# Altium project Mongo KVM.PrjPcb
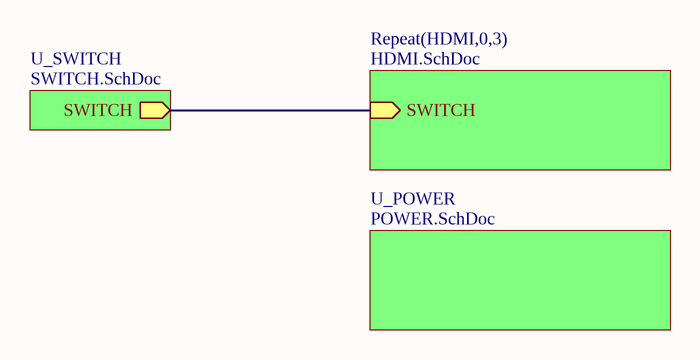
[diagram p0: TOP.SchDoc]
7 sheets, 38 parts. Net scope: hierarchical (ports join the sheet entries above them; power ports are global).
Board file: MONGO_KVM.PcbDoc
Sheets:
  TOP.SchDoc
    HDMI0 = HDMI.SchDoc
      U_HDMI_IN = HDMI_IN.SchDoc
      U_HDMI_SWITCH = HDMI_SWITCH.SchDoc
      U_HDMI_OUT = HDMI_OUT.SchDoc
    HDMI1 = HDMI.SchDoc
      U_HDMI_IN = HDMI_IN.SchDoc
      U_HDMI_SWITCH = HDMI_SWITCH.SchDoc
      U_HDMI_OUT = HDMI_OUT.SchDoc
    HDMI2 = HDMI.SchDoc
      U_HDMI_IN = HDMI_IN.SchDoc
      U_HDMI_SWITCH = HDMI_SWITCH.SchDoc
      U_HDMI_OUT = HDMI_OUT.SchDoc
    HDMI3 = HDMI.SchDoc
      U_HDMI_IN = HDMI_IN.SchDoc
      U_HDMI_SWITCH = HDMI_SWITCH.SchDoc
      U_HDMI_OUT = HDMI_OUT.SchDoc
    U_POWER = POWER.SchDoc
    U_SWITCH = SWITCH.SchDoc

## Sheet TOP.SchDoc
size A; SheetNumber: 1; SheetTotal: 7

### Sub-sheets
Repeat(HDMI,0,3) = HDMI.SchDoc: SWITCH (in)
U_POWER = POWER.SchDoc: no entries
U_SWITCH = SWITCH.SchDoc: SWITCH (out)

### Nets
NetQ1_4: sheet Repeat(HDMI,0,3)/SWITCH, sheet U_SWITCH/SWITCH

## Sheet HDMI.SchDoc
size A; SheetNumber: 2; SheetTotal: 12
Used 4 times, as channels HDMI0, HDMI1, HDMI2, HDMI3. Parts and nets are listed once, with the designators drawn on the sheet.
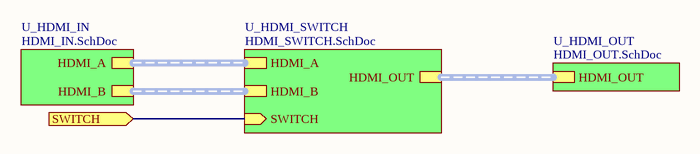
[diagram p1: HDMI.SchDoc]

### Sub-sheets
U_HDMI_IN = HDMI_IN.SchDoc: HDMI_A (harness HDMI_A), HDMI_B (harness HDMI_B)
U_HDMI_OUT = HDMI_OUT.SchDoc: HDMI_OUT (harness HDMI_OUT)
U_HDMI_SWITCH = HDMI_SWITCH.SchDoc: HDMI_A (harness HDMI_A), HDMI_B (harness HDMI_B), HDMI_OUT (harness HDMI_OUT), SWITCH (in)

### Ports
SWITCH (in, see TOP[2B], HDMI_SWITCH[1C])

### Nets
SWITCH: port SWITCH, sheet U_HDMI_SWITCH/SWITCH

### Channels
HDMI0: ports SWITCH=NetQ1_4
HDMI1: ports SWITCH=NetQ1_4
HDMI2: ports SWITCH=NetQ1_4
HDMI3: ports SWITCH=NetQ1_4

### Buses and harness runs
harness sheet U_HDMI_IN/HDMI_A = sheet U_HDMI_SWITCH/HDMI_A
harness sheet U_HDMI_IN/HDMI_B = sheet U_HDMI_SWITCH/HDMI_B
harness sheet U_HDMI_OUT/HDMI_OUT = sheet U_HDMI_SWITCH/HDMI_OUT

## Sheet HDMI_IN.SchDoc
size A; SheetNumber: 4; SheetTotal: 12
Used 4 times, as channels HDMI0/U_HDMI_IN, HDMI1/U_HDMI_IN, HDMI2/U_HDMI_IN, HDMI3/U_HDMI_IN. Parts and nets are listed once, with the designators drawn on the sheet.
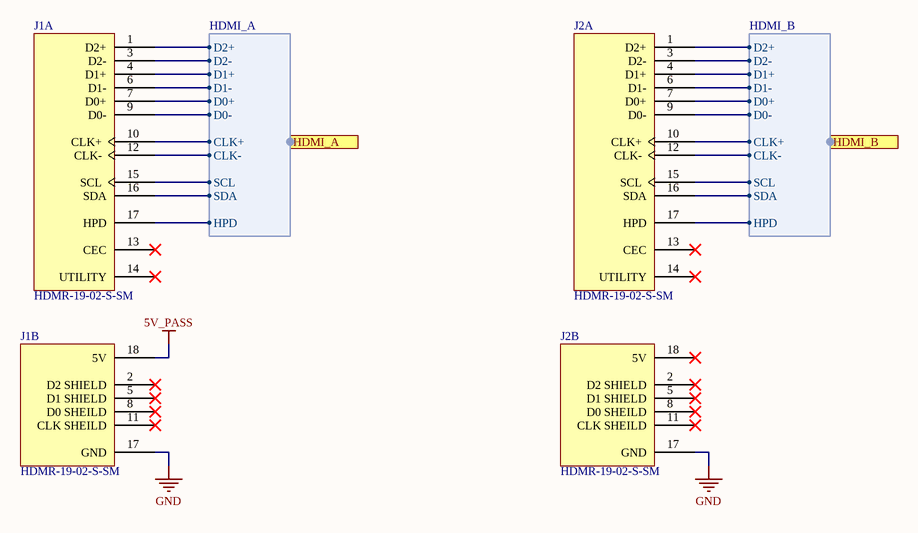
[diagram p2: HDMI_IN.SchDoc]

### Parts
J1  HDMR-19-02-S-SM  [SAMTEC_HDMR-19-02-S-SM]  (parts A,B of 2)
J2  HDMR-19-02-S-SM  [SAMTEC_HDMR-19-02-S-SM]  (parts A,B of 2)

### Ports
HDMI_A (harness HDMI_A, see HDMI[2B], HDMI_SWITCH[1A]), HDMI_B (harness HDMI_B, see HDMI[2B], HDMI_SWITCH[1B])

### Harnesses
HDMI_A: SCL, SDA, HPD, D0+, D0-, D1+, D1-, D2+, D2-, CLK+, CLK-
HDMI_B: SCL, SDA, HPD, D0+, D0-, D1+, D1-, D2+, D2-, CLK+, CLK-

### Nets
5V_PASS: J1.18(5V)
GND: J1.17(GND) J2.17(GND)
NetJ1_1: J1.1(D2+) ; port HDMI_A.D2+
NetJ1_3: J1.3(D2-) ; port HDMI_A.D2-
NetJ1_4: J1.4(D1+) ; port HDMI_A.D1+
NetJ1_6: J1.6(D1-) ; port HDMI_A.D1-
NetJ1_7: J1.7(D0+) ; port HDMI_A.D0+
NetJ1_9: J1.9(D0-) ; port HDMI_A.D0-
NetJ1_10: J1.10(CLK+) ; port HDMI_A.CLK+
NetJ1_12: J1.12(CLK-) ; port HDMI_A.CLK-
NetJ1_15: J1.15(SCL) ; port HDMI_A.SCL
NetJ1_16: J1.16(SDA) ; port HDMI_A.SDA
NetJ1_17: J1.17(HPD) ; port HDMI_A.HPD
NetJ2_1: J2.1(D2+) ; port HDMI_B.D2+
NetJ2_3: J2.3(D2-) ; port HDMI_B.D2-
NetJ2_4: J2.4(D1+) ; port HDMI_B.D1+
NetJ2_6: J2.6(D1-) ; port HDMI_B.D1-
NetJ2_7: J2.7(D0+) ; port HDMI_B.D0+
NetJ2_9: J2.9(D0-) ; port HDMI_B.D0-
NetJ2_10: J2.10(CLK+) ; port HDMI_B.CLK+
NetJ2_12: J2.12(CLK-) ; port HDMI_B.CLK-
NetJ2_15: J2.15(SCL) ; port HDMI_B.SCL
NetJ2_16: J2.16(SDA) ; port HDMI_B.SDA
NetJ2_17: J2.17(HPD) ; port HDMI_B.HPD

Not connected (* = marked no-connect by the designer): J1 2(D2_SHIELD)* 5(D1_SHIELD)* 8(D0_SHEILD)* 11(CLK_SHEILD)* 13(CEC)* 14(UTILITY)*; J2 2(D2_SHIELD)* 5(D1_SHIELD)* 8(D0_SHEILD)* 11(CLK_SHEILD)* 13(CEC)* 14(UTILITY)* 18(5V)*

### Channels
HDMI0/U_HDMI_IN: designators end in _HDMI0_U_HDMI_IN
HDMI1/U_HDMI_IN: designators end in _HDMI1_U_HDMI_IN
HDMI2/U_HDMI_IN: designators end in _HDMI2_U_HDMI_IN
HDMI3/U_HDMI_IN: designators end in _HDMI3_U_HDMI_IN

### Library data of the parts
J1 J2 = SAMTEC_HDMR-19-02-S-SM: Conn HDMI RCP 19 POS 0.5mm Solder RA SMD 19 Terminal 1 Port

## Sheet HDMI_SWITCH.SchDoc
size A; SheetNumber: 5; SheetTotal: 12
Used 4 times, as channels HDMI0/U_HDMI_SWITCH, HDMI1/U_HDMI_SWITCH, HDMI2/U_HDMI_SWITCH, HDMI3/U_HDMI_SWITCH. Parts and nets are listed once, with the designators drawn on the sheet.
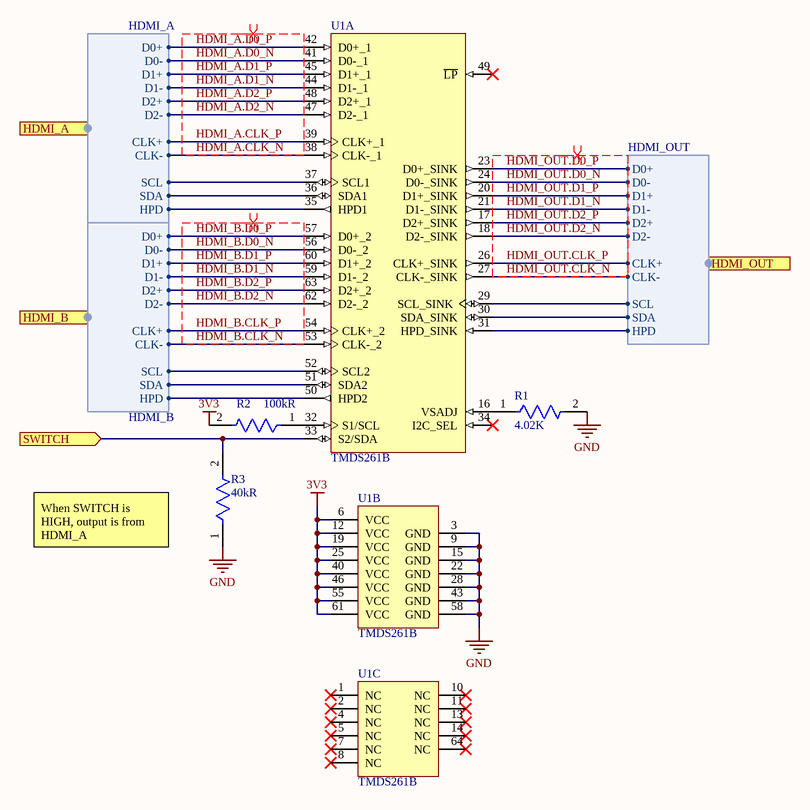
[diagram p3: HDMI_SWITCH.SchDoc]

### Parts
R1  value 4.02K  [FP-RT0402-MFG]  (hidden comment: RT0402)
R2  Resistance: 100kR  [FP-RK73H1J-IPC_C]  (hidden comment: RK73H1JLTD1003F)
R3  Resistance: 40kR  [FP-CRCW0805-e3-MFG]  (hidden comment: CRCW080540K0FKEA)
U1  TMDS261B  [PAG0064A_N]  (parts A,B,C of 3)

### Ports
HDMI_A (harness HDMI_A, see HDMI[2B], HDMI_IN[2B]), HDMI_B (harness HDMI_B, see HDMI[2B], HDMI_IN[4B]), HDMI_OUT (harness HDMI_OUT, see HDMI[3B], HDMI_OUT[2B]), SWITCH (in, see HDMI[2B], SWITCH[4B], USB[2C], USB_SWITCH_A[1B], USB_SWITCH_B[1B])

### Harnesses
HDMI_A: SCL, SDA, HPD, D0+, D0-, D1+, D1-, D2+, D2-, CLK+, CLK-
HDMI_B: SCL, SDA, HPD, D0+, D0-, D1+, D1-, D2+, D2-, CLK+, CLK-
HDMI_OUT: SCL, SDA, HPD, D0+, D0-, D1+, D1-, D2+, D2-, CLK+, CLK-

### Nets
3V3: R2.2 U1.6(VCC) U1.12(VCC) U1.19(VCC) U1.25(VCC) U1.40(VCC) U1.46(VCC) U1.55(VCC) U1.61(VCC)
GND: R1.2 R3.1 U1.3(GND) U1.9(GND) U1.15(GND) U1.22(GND) U1.28(GND) U1.43(GND) U1.58(GND)
HDMI_A.CLK_N: U1.38(CLK-_1) ; port HDMI_A.CLK-
HDMI_A.CLK_P: U1.39(CLK+_1) ; port HDMI_A.CLK+
HDMI_A.D0_N: U1.41(D0-_1) ; port HDMI_A.D0-
HDMI_A.D0_P: U1.42(D0+_1) ; port HDMI_A.D0+
HDMI_A.D1_N: U1.44(D1-_1) ; port HDMI_A.D1-
HDMI_A.D1_P: U1.45(D1+_1) ; port HDMI_A.D1+
HDMI_A.D2_N: U1.47(D2-_1) ; port HDMI_A.D2-
HDMI_A.D2_P: U1.48(D2+_1) ; port HDMI_A.D2+
HDMI_B.CLK_N: U1.53(CLK-_2) ; port HDMI_B.CLK-
HDMI_B.CLK_P: U1.54(CLK+_2) ; port HDMI_B.CLK+
HDMI_B.D0_N: U1.56(D0-_2) ; port HDMI_B.D0-
HDMI_B.D0_P: U1.57(D0+_2) ; port HDMI_B.D0+
HDMI_B.D1_N: U1.59(D1-_2) ; port HDMI_B.D1-
HDMI_B.D1_P: U1.60(D1+_2) ; port HDMI_B.D1+
HDMI_B.D2_N: U1.62(D2-_2) ; port HDMI_B.D2-
HDMI_B.D2_P: U1.63(D2+_2) ; port HDMI_B.D2+
HDMI_OUT.CLK_N: U1.27(CLK-_SINK) ; port HDMI_OUT.CLK-
HDMI_OUT.CLK_P: U1.26(CLK+_SINK) ; port HDMI_OUT.CLK+
HDMI_OUT.D0_N: U1.24(D0-_SINK) ; port HDMI_OUT.D0-
HDMI_OUT.D0_P: U1.23(D0+_SINK) ; port HDMI_OUT.D0+
HDMI_OUT.D1_N: U1.21(D1-_SINK) ; port HDMI_OUT.D1-
HDMI_OUT.D1_P: U1.20(D1+_SINK) ; port HDMI_OUT.D1+
HDMI_OUT.D2_N: U1.18(D2-_SINK) ; port HDMI_OUT.D2-
HDMI_OUT.D2_P: U1.17(D2+_SINK) ; port HDMI_OUT.D2+
SWITCH: R3.2 U1.33(S2/SDA) ; port SWITCH
NetR1_1: R1.1 U1.16(VSADJ)
NetR2_1: R2.1 U1.32(S1/SCL)
NetU1_29: U1.29(SCL_SINK) ; port HDMI_OUT.SCL
NetU1_30: U1.30(SDA_SINK) ; port HDMI_OUT.SDA
NetU1_31: U1.31(HPD_SINK) ; port HDMI_OUT.HPD
NetU1_35: U1.35(HPD1) ; port HDMI_A.HPD
NetU1_36: U1.36(SDA1) ; port HDMI_A.SDA
NetU1_37: U1.37(SCL1) ; port HDMI_A.SCL
NetU1_50: U1.50(HPD2) ; port HDMI_B.HPD
NetU1_51: U1.51(SDA2) ; port HDMI_B.SDA
NetU1_52: U1.52(SCL2) ; port HDMI_B.SCL

Not connected (* = marked no-connect by the designer): U1 1(NC)* 2(NC)* 4(NC)* 5(NC)* 7(NC)* 8(NC)* 10(NC)* 11(NC)* 13(NC)* 14(NC)* 34(I2C_SEL)* 49(~{LP})* 64(NC)*

### Channels
HDMI0/U_HDMI_SWITCH: designators end in _HDMI0_U_HDMI_SWITCH; ports SWITCH=NetQ1_4
HDMI1/U_HDMI_SWITCH: designators end in _HDMI1_U_HDMI_SWITCH; ports SWITCH=NetQ1_4
HDMI2/U_HDMI_SWITCH: designators end in _HDMI2_U_HDMI_SWITCH; ports SWITCH=NetQ1_4
HDMI3/U_HDMI_SWITCH: designators end in _HDMI3_U_HDMI_SWITCH; ports SWITCH=NetQ1_4

### Layout directives
differential pair: HDMI_A.CLK_N, HDMI_A.CLK_P, HDMI_A.D0_N, HDMI_A.D0_P, HDMI_A.D1_N, HDMI_A.D1_P, HDMI_A.D2_N, HDMI_A.D2_P, HDMI_B.CLK_N, HDMI_B.CLK_P, HDMI_B.D0_N, HDMI_B.D0_P, HDMI_B.D1_N, HDMI_B.D1_P, HDMI_B.D2_N, HDMI_B.D2_P, HDMI_OUT.CLK_N, HDMI_OUT.CLK_P, HDMI_OUT.D0_N, HDMI_OUT.D0_P, HDMI_OUT.D1_N, HDMI_OUT.D1_P, HDMI_OUT.D2_N, HDMI_OUT.D2_P

### Notes on the sheet
- When SWITCH is HIGH, output is from HDMI_A

### Library data of the parts
R1 = RT0402: RT0402 4.02KΩ 0.063W 50 ppm/°C 1.00%
R2 = CMP-04015-074272-1: 100kΩ ±1% 0.1W Chip Resistor 0603 Thick Film AEC-Q200 Qualified; Temperature Coefficient: 100ppm/°C; Power Rating: 100mW; Voltage Rating: 50V; Series: RK73H; Case/Package: 0603; Max Operating Temperature: 155°C; Case Code (Imperial): 0603; Length: 1.6mm; Package Quantity: 5000; Min Operating Temperature: -55°C; Tolerance: 1%; Termination: SMD/SMT; Packaging: Tape and Reel; Case Code (Metric): 1608; Height: 0.45mm; Width: 0.8mm; Lead Free: Contains Lead
R3 = CMP-02407-003498-1: RES Thick Film, 40kΩ, 1%, 0.125W, 100ppm/°C, 0805; Max Power Dissipation: 125mW; Tolerance: 1%; Features: Automotive AEC-Q200; Max Operating Temperature: 155°C; Composition: Thick Film; Length: 0.079inch; Case/Package: 0805; Min Operating Temperature: -55°C; Packaging: Tape and Reel; Number of Terminations: 2; Width: 0.049inch; Height: 0.02inch; Package Quantity: 5000; Lead Free: Lead Free; Temperature Coefficient: 100ppm/°C
U1 = TMDS261B: 3-Gbps 2-to-1 HDMI/DVI mux with adaptive equalization 64-TQFP 0 to 70

## Sheet HDMI_OUT.SchDoc
size A; SheetNumber: 6; SheetTotal: 10
Used 4 times, as channels HDMI0/U_HDMI_OUT, HDMI1/U_HDMI_OUT, HDMI2/U_HDMI_OUT, HDMI3/U_HDMI_OUT. Parts and nets are listed once, with the designators drawn on the sheet.
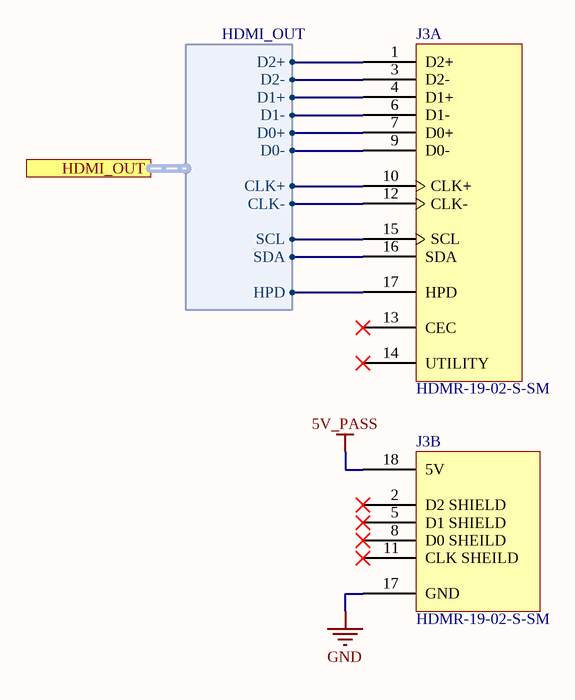
[diagram p4: HDMI_OUT.SchDoc]

### Parts
J3  HDMR-19-02-S-SM  [SAMTEC_HDMR-19-02-S-SM]  (parts A,B of 2)

### Ports
HDMI_OUT (harness HDMI_OUT, see HDMI[3B], HDMI_SWITCH[3B])

### Harnesses
HDMI_OUT: SCL, SDA, HPD, D0+, D0-, D1+, D1-, D2+, D2-, CLK+, CLK-

### Nets
5V_PASS: J3.18(5V)
GND: J3.17(GND)
NetJ3_1: J3.1(D2+) ; port HDMI_OUT.D2+
NetJ3_3: J3.3(D2-) ; port HDMI_OUT.D2-
NetJ3_4: J3.4(D1+) ; port HDMI_OUT.D1+
NetJ3_6: J3.6(D1-) ; port HDMI_OUT.D1-
NetJ3_7: J3.7(D0+) ; port HDMI_OUT.D0+
NetJ3_9: J3.9(D0-) ; port HDMI_OUT.D0-
NetJ3_10: J3.10(CLK+) ; port HDMI_OUT.CLK+
NetJ3_12: J3.12(CLK-) ; port HDMI_OUT.CLK-
NetJ3_15: J3.15(SCL) ; port HDMI_OUT.SCL
NetJ3_16: J3.16(SDA) ; port HDMI_OUT.SDA
NetJ3_17: J3.17(HPD) ; port HDMI_OUT.HPD

Not connected (* = marked no-connect by the designer): J3 2(D2_SHIELD)* 5(D1_SHIELD)* 8(D0_SHEILD)* 11(CLK_SHEILD)* 13(CEC)* 14(UTILITY)*

### Channels
HDMI0/U_HDMI_OUT: designators end in _HDMI0_U_HDMI_OUT
HDMI1/U_HDMI_OUT: designators end in _HDMI1_U_HDMI_OUT
HDMI2/U_HDMI_OUT: designators end in _HDMI2_U_HDMI_OUT
HDMI3/U_HDMI_OUT: designators end in _HDMI3_U_HDMI_OUT

### Library data of the parts
J3 = SAMTEC_HDMR-19-02-S-SM: as J1 on sheet HDMI_IN

## Sheet POWER.SchDoc
size A; SheetNumber: 7; SheetTotal: 7
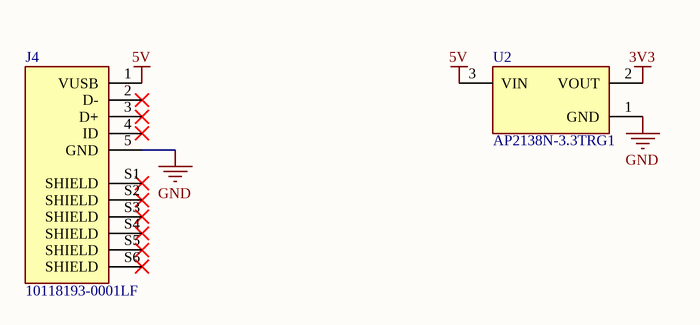
[diagram p5: POWER.SchDoc]

### Parts
J4  10118193-0001LF  [FCI_10118193-0001LF]
U2  AP2138N-3.3TRG1  [FP-SOT23-MFG]

### Nets
3V3: U2.2(VOUT)
5V: J4.1(VUSB) U2.3(VIN)
GND: J4.5(GND) U2.1(GND)

Not connected (* = marked no-connect by the designer): J4 2(D-)* 3(D+)* 4(ID)* S1(SHIELD)* S2(SHIELD)* S3(SHIELD)* S4(SHIELD)* S5(SHIELD)* S6(SHIELD)*

### Library data of the parts
J4 = 10118193-0001LF: USB - micro B USB 2.0 Receptacle Connector 5 Position Surface Mount, Right Angle; Through Hole; MF: Amphenol ICC; Availability: Unavailable; SnapEDA_Link: https://www.snapeda.com/parts/10118193-0001LF/Amphenol%20FCI/view-part/2758989/?ref=snap; MP: 10118193-0001LF; Price: None; Value: *; Package: None
U2 = AP2138N-3.3TRG1: IC REG LINEAR 3.3V 250MA SOT23-3

## Sheet SWITCH.SchDoc: SWITCH
size A; SheetNumber: 2; SheetTotal: 7
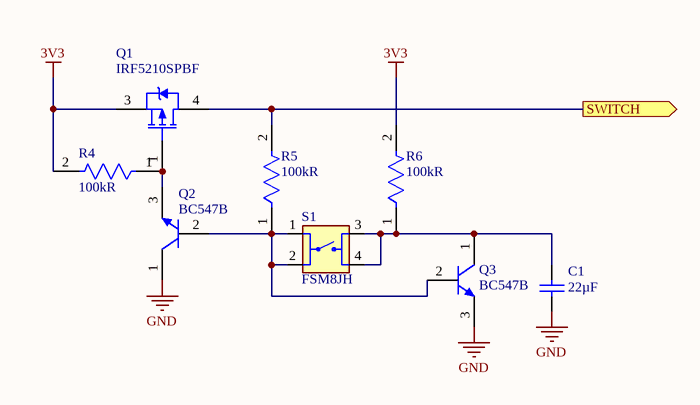
[diagram p6: SWITCH.SchDoc]

### Parts
C1  Capacitance: 22µF  [CAPC1608X100X20ML10]  (hidden comment: C1608X5R1A226M080AC)
Q1  IRF5210SPBF  [INTR-TO-263-3_L]
Q2  BC547B  [ONSC-TO-92-3-29-11]
Q3  BC547B  [ONSC-TO-92-3-29-11]
R4  Resistance: 100kR  [FP-RK73H1J-IPC_C]  (hidden comment: RK73H1JLTD1003F)
R5  Resistance: 100kR  [FP-RK73H1J-IPC_C]  (hidden comment: RK73H1JLTD1003F)
R6  Resistance: 100kR  [FP-RK73H1J-IPC_C]  (hidden comment: RK73H1JLTD1003F)
S1  FSM8JH  [SW_FSM8JH]

### Ports
SWITCH (out, see TOP[2B], HDMI[2B], HDMI_SWITCH[1C])

### Nets
3V3: Q1.3(SOURCE) R4.2 R6.2
GND: C1.1 Q2.1(C) Q3.3(E)
NetC1_2: C1.2 Q3.1(C) R6.1 S1.3 S1.4
NetQ1_1: Q1.1(GATE) Q2.3(E) R4.1
NetQ1_4: Q1.4(DRAIN) R5.2 ; port SWITCH
NetQ2_2: Q2.2(B) Q3.2(B) R5.1 S1.1 S1.2

### Library data of the parts
C1 = CMP-2000-05441-1: Chip Capacitor, 22 uF, +/- 20%, 10 V, -55 to 85 degC, 0603 (1608 Metric), RoHS, Tape and Reel; Manufacturer: TDK; PCN Part Number: MLCCPartNumberChange30/Nov/2012; Voltage - Rated: 10V; Product Training Modules: CSeriesGeneralApplicationsSEAT,CCV,andTVCLDesignToolsGuidetoReplacinganElectrolyticCapacitorwithanMLCC; Other Names: 445-9077-1; Design Resources: 20WNon-IsolatedBuckLEDDriverUsingPLLNK460KG; Online Catalog: CSeries,GeneralPurpose; Temperature Coefficient: X5R; Kits: 445-9014-KIT-ND-KITMLCC100PF-22UF060310-50V; Packaging: CutTape(CT); Standard Package: 1; Package / Case: 0603(1608Metric); Lead Style: -; Features: -; Ratings: -; Operating Temperature: -55degC~85degC; Applications: GeneralPurpose; Package Reference: 603; Datasheet URL: http://download.siliconexpert.com/pdfs/2015/4/21/15/54/45/779/tdk_/manual/37024850441143360mlcc_commercial_general_en.pdf; Datasheet Version: Mar-15; Mounting Type: SurfaceMount,MLCC; Lead Spacing: -; Size / Dimension: 0.063"Lx0.031"W(1.60mmx0.80mm); Height - Seated (Max): -; Package Description: 2-Pin Surface Mount Device, Body 1.6 x 0.8 mm; Manufacturer URL: http://www.tdk.com/; RoHS Information: RoHSCertificate-MLCC; Tolerance: ±20%; Series: C; Thickness (Max): 0.035"(0.90mm); Family: CeramicCapacitors; Category: Capacitors
Q1 = CMP-2000-06459-1: HEXFET(R) Power MOSFET, 3.1 W, 63 ns, -55 to 150 degC, 3-Pin DPAK (TO-263AB), RoHS, Tube; Manufacturer: International Rectifier; Drain-Source On Resistance-Max: 60mO; Rated Power Dissipation: 170W; Qg Gate Charge: 150nC; Channel Type: P-Channel; Drain-to-Source Voltage [Vdss]: 100V; Datasheet Version: 08/2009; Datasheet URL: https://datasheet.ciiva.com/15137/getdatasheetpartid-86705-15137623.pdf; Package Reference: TO-263-3; Package Description: 3-Pin Transistor Outline, Body 9.015 x 10.16 mm, Pitch 2.54 mm; Manufacturer URL: http://internationalrectifier.com/; Mounting Technology: SurfaceMount
Q2 Q3 = CMP-1048-01467-1: Amplifier Transistor, NPN Silicon, 3-Pin TO-92, Bulk Box; Manufacturer: On Semiconductor; IC Continuous (A): 0.1; fT Min (MHz): 150; DatasheetVersion: Rev. 7; ComponentLink1URL: http://www.onsemi.com/; Polarity: NPN; RoHS: FALSE; ComponentLink1Description: Manufacturer URL; Packing: Bulk Box; PackageDescription: 3-Pin Transistor Outline, Body 4.825 x 3.685 mm, Pitch 1.27 mm; ComponentLink3URL: http://www.onsemi.cn/pub_link/Collateral/2N6426-D.PDF; ComponentLink2Description: Datasheet; PackageVersion: Rev. AM; PackageReference: TO-92-3-29-11_AM_SL; ComponentLink3Description: Package Specification; Mounting Technology: Through Hole; PartNumber: BC547B; ComponentLink2URL: http://www.onsemi.com/pub_link/Collateral/BC546-D.PDF
R4-R6 = CMP-04015-074272-1: as R2 on sheet HDMI_SWITCH; Series: RK73H; Case/Package: 0603; Max Operating Temperature: 155°C; Case Code (Imperial): 0603; Length: 1.6mm; Package Quantity: 5000; Min Operating Temperature: -55°C; Tolerance: 1%; Termination: SMD/SMT; Packaging: Tape and Reel; Case Code (Metric): 1608; Height: 0.45mm; Width: 0.8mm; Lead Free: Contains Lead
S1 = FSM8JH: Switch, Pushbutton, Tactile, SPST, Thru Hole, Vertical, 6MM, Black; Value: *; MP: FSM8JH; Package: None; Availability: Unavailable; Price: None

## Nets that join several sheets
3V3: HDMI0/U_HDMI_SWITCH (9 pins), HDMI1/U_HDMI_SWITCH (9 pins), HDMI2/U_HDMI_SWITCH (9 pins), HDMI3/U_HDMI_SWITCH (9 pins), POWER (U2.2), SWITCH (Q1.3 R4.2 R6.2)
5V_PASS: HDMI0/U_HDMI_IN (J1_HDMI0_U_HDMI_IN.18), HDMI0/U_HDMI_OUT (J3_HDMI0_U_HDMI_OUT.18), HDMI1/U_HDMI_IN (J1_HDMI1_U_HDMI_IN.18), HDMI1/U_HDMI_OUT (J3_HDMI1_U_HDMI_OUT.18), HDMI2/U_HDMI_IN (J1_HDMI2_U_HDMI_IN.18), HDMI2/U_HDMI_OUT (J3_HDMI2_U_HDMI_OUT.18), HDMI3/U_HDMI_IN (J1_HDMI3_U_HDMI_IN.18), HDMI3/U_HDMI_OUT (J3_HDMI3_U_HDMI_OUT.18)
GND: HDMI0/U_HDMI_IN (J1_HDMI0_U_HDMI_IN.17 J2_HDMI0_U_HDMI_IN.17), HDMI0/U_HDMI_SWITCH (9 pins), HDMI0/U_HDMI_OUT (J3_HDMI0_U_HDMI_OUT.17), HDMI1/U_HDMI_IN (J1_HDMI1_U_HDMI_IN.17 J2_HDMI1_U_HDMI_IN.17), HDMI1/U_HDMI_SWITCH (9 pins), HDMI1/U_HDMI_OUT (J3_HDMI1_U_HDMI_OUT.17), HDMI2/U_HDMI_IN (J1_HDMI2_U_HDMI_IN.17 J2_HDMI2_U_HDMI_IN.17), HDMI2/U_HDMI_SWITCH (9 pins), HDMI2/U_HDMI_OUT (J3_HDMI2_U_HDMI_OUT.17), HDMI3/U_HDMI_IN (J1_HDMI3_U_HDMI_IN.17 J2_HDMI3_U_HDMI_IN.17), HDMI3/U_HDMI_SWITCH (9 pins), HDMI3/U_HDMI_OUT (J3_HDMI3_U_HDMI_OUT.17), POWER (J4.5 U2.1), SWITCH (C1.1 Q2.1 Q3.3)
HDMI_A.CLK_N: HDMI0/U_HDMI_IN (J1_HDMI0_U_HDMI_IN.12), HDMI0/U_HDMI_SWITCH (U1_HDMI0_U_HDMI_SWITCH.38)
HDMI_A.CLK_N: HDMI1/U_HDMI_IN (J1_HDMI1_U_HDMI_IN.12), HDMI1/U_HDMI_SWITCH (U1_HDMI1_U_HDMI_SWITCH.38)
HDMI_A.CLK_N: HDMI2/U_HDMI_IN (J1_HDMI2_U_HDMI_IN.12), HDMI2/U_HDMI_SWITCH (U1_HDMI2_U_HDMI_SWITCH.38)
HDMI_A.CLK_N: HDMI3/U_HDMI_IN (J1_HDMI3_U_HDMI_IN.12), HDMI3/U_HDMI_SWITCH (U1_HDMI3_U_HDMI_SWITCH.38)
HDMI_A.CLK_P: HDMI0/U_HDMI_IN (J1_HDMI0_U_HDMI_IN.10), HDMI0/U_HDMI_SWITCH (U1_HDMI0_U_HDMI_SWITCH.39)
HDMI_A.CLK_P: HDMI1/U_HDMI_IN (J1_HDMI1_U_HDMI_IN.10), HDMI1/U_HDMI_SWITCH (U1_HDMI1_U_HDMI_SWITCH.39)
HDMI_A.CLK_P: HDMI2/U_HDMI_IN (J1_HDMI2_U_HDMI_IN.10), HDMI2/U_HDMI_SWITCH (U1_HDMI2_U_HDMI_SWITCH.39)
HDMI_A.CLK_P: HDMI3/U_HDMI_IN (J1_HDMI3_U_HDMI_IN.10), HDMI3/U_HDMI_SWITCH (U1_HDMI3_U_HDMI_SWITCH.39)
HDMI_A.D0_N: HDMI0/U_HDMI_IN (J1_HDMI0_U_HDMI_IN.9), HDMI0/U_HDMI_SWITCH (U1_HDMI0_U_HDMI_SWITCH.41)
HDMI_A.D0_N: HDMI1/U_HDMI_IN (J1_HDMI1_U_HDMI_IN.9), HDMI1/U_HDMI_SWITCH (U1_HDMI1_U_HDMI_SWITCH.41)
HDMI_A.D0_N: HDMI2/U_HDMI_IN (J1_HDMI2_U_HDMI_IN.9), HDMI2/U_HDMI_SWITCH (U1_HDMI2_U_HDMI_SWITCH.41)
HDMI_A.D0_N: HDMI3/U_HDMI_IN (J1_HDMI3_U_HDMI_IN.9), HDMI3/U_HDMI_SWITCH (U1_HDMI3_U_HDMI_SWITCH.41)
HDMI_A.D0_P: HDMI0/U_HDMI_IN (J1_HDMI0_U_HDMI_IN.7), HDMI0/U_HDMI_SWITCH (U1_HDMI0_U_HDMI_SWITCH.42)
HDMI_A.D0_P: HDMI1/U_HDMI_IN (J1_HDMI1_U_HDMI_IN.7), HDMI1/U_HDMI_SWITCH (U1_HDMI1_U_HDMI_SWITCH.42)
HDMI_A.D0_P: HDMI2/U_HDMI_IN (J1_HDMI2_U_HDMI_IN.7), HDMI2/U_HDMI_SWITCH (U1_HDMI2_U_HDMI_SWITCH.42)
HDMI_A.D0_P: HDMI3/U_HDMI_IN (J1_HDMI3_U_HDMI_IN.7), HDMI3/U_HDMI_SWITCH (U1_HDMI3_U_HDMI_SWITCH.42)
HDMI_A.D1_N: HDMI0/U_HDMI_IN (J1_HDMI0_U_HDMI_IN.6), HDMI0/U_HDMI_SWITCH (U1_HDMI0_U_HDMI_SWITCH.44)
HDMI_A.D1_N: HDMI1/U_HDMI_IN (J1_HDMI1_U_HDMI_IN.6), HDMI1/U_HDMI_SWITCH (U1_HDMI1_U_HDMI_SWITCH.44)
HDMI_A.D1_N: HDMI2/U_HDMI_IN (J1_HDMI2_U_HDMI_IN.6), HDMI2/U_HDMI_SWITCH (U1_HDMI2_U_HDMI_SWITCH.44)
HDMI_A.D1_N: HDMI3/U_HDMI_IN (J1_HDMI3_U_HDMI_IN.6), HDMI3/U_HDMI_SWITCH (U1_HDMI3_U_HDMI_SWITCH.44)
HDMI_A.D1_P: HDMI0/U_HDMI_IN (J1_HDMI0_U_HDMI_IN.4), HDMI0/U_HDMI_SWITCH (U1_HDMI0_U_HDMI_SWITCH.45)
HDMI_A.D1_P: HDMI1/U_HDMI_IN (J1_HDMI1_U_HDMI_IN.4), HDMI1/U_HDMI_SWITCH (U1_HDMI1_U_HDMI_SWITCH.45)
HDMI_A.D1_P: HDMI2/U_HDMI_IN (J1_HDMI2_U_HDMI_IN.4), HDMI2/U_HDMI_SWITCH (U1_HDMI2_U_HDMI_SWITCH.45)
HDMI_A.D1_P: HDMI3/U_HDMI_IN (J1_HDMI3_U_HDMI_IN.4), HDMI3/U_HDMI_SWITCH (U1_HDMI3_U_HDMI_SWITCH.45)
HDMI_A.D2_N: HDMI0/U_HDMI_IN (J1_HDMI0_U_HDMI_IN.3), HDMI0/U_HDMI_SWITCH (U1_HDMI0_U_HDMI_SWITCH.47)
HDMI_A.D2_N: HDMI1/U_HDMI_IN (J1_HDMI1_U_HDMI_IN.3), HDMI1/U_HDMI_SWITCH (U1_HDMI1_U_HDMI_SWITCH.47)
HDMI_A.D2_N: HDMI2/U_HDMI_IN (J1_HDMI2_U_HDMI_IN.3), HDMI2/U_HDMI_SWITCH (U1_HDMI2_U_HDMI_SWITCH.47)
HDMI_A.D2_N: HDMI3/U_HDMI_IN (J1_HDMI3_U_HDMI_IN.3), HDMI3/U_HDMI_SWITCH (U1_HDMI3_U_HDMI_SWITCH.47)
HDMI_A.D2_P: HDMI0/U_HDMI_IN (J1_HDMI0_U_HDMI_IN.1), HDMI0/U_HDMI_SWITCH (U1_HDMI0_U_HDMI_SWITCH.48)
HDMI_A.D2_P: HDMI1/U_HDMI_IN (J1_HDMI1_U_HDMI_IN.1), HDMI1/U_HDMI_SWITCH (U1_HDMI1_U_HDMI_SWITCH.48)
HDMI_A.D2_P: HDMI2/U_HDMI_IN (J1_HDMI2_U_HDMI_IN.1), HDMI2/U_HDMI_SWITCH (U1_HDMI2_U_HDMI_SWITCH.48)
HDMI_A.D2_P: HDMI3/U_HDMI_IN (J1_HDMI3_U_HDMI_IN.1), HDMI3/U_HDMI_SWITCH (U1_HDMI3_U_HDMI_SWITCH.48)
HDMI_B.CLK_N: HDMI0/U_HDMI_IN (J2_HDMI0_U_HDMI_IN.12), HDMI0/U_HDMI_SWITCH (U1_HDMI0_U_HDMI_SWITCH.53)
HDMI_B.CLK_N: HDMI1/U_HDMI_IN (J2_HDMI1_U_HDMI_IN.12), HDMI1/U_HDMI_SWITCH (U1_HDMI1_U_HDMI_SWITCH.53)
HDMI_B.CLK_N: HDMI2/U_HDMI_IN (J2_HDMI2_U_HDMI_IN.12), HDMI2/U_HDMI_SWITCH (U1_HDMI2_U_HDMI_SWITCH.53)
HDMI_B.CLK_N: HDMI3/U_HDMI_IN (J2_HDMI3_U_HDMI_IN.12), HDMI3/U_HDMI_SWITCH (U1_HDMI3_U_HDMI_SWITCH.53)
HDMI_B.CLK_P: HDMI0/U_HDMI_IN (J2_HDMI0_U_HDMI_IN.10), HDMI0/U_HDMI_SWITCH (U1_HDMI0_U_HDMI_SWITCH.54)
HDMI_B.CLK_P: HDMI1/U_HDMI_IN (J2_HDMI1_U_HDMI_IN.10), HDMI1/U_HDMI_SWITCH (U1_HDMI1_U_HDMI_SWITCH.54)
HDMI_B.CLK_P: HDMI2/U_HDMI_IN (J2_HDMI2_U_HDMI_IN.10), HDMI2/U_HDMI_SWITCH (U1_HDMI2_U_HDMI_SWITCH.54)
HDMI_B.CLK_P: HDMI3/U_HDMI_IN (J2_HDMI3_U_HDMI_IN.10), HDMI3/U_HDMI_SWITCH (U1_HDMI3_U_HDMI_SWITCH.54)
HDMI_B.D0_N: HDMI0/U_HDMI_IN (J2_HDMI0_U_HDMI_IN.9), HDMI0/U_HDMI_SWITCH (U1_HDMI0_U_HDMI_SWITCH.56)
HDMI_B.D0_N: HDMI1/U_HDMI_IN (J2_HDMI1_U_HDMI_IN.9), HDMI1/U_HDMI_SWITCH (U1_HDMI1_U_HDMI_SWITCH.56)
HDMI_B.D0_N: HDMI2/U_HDMI_IN (J2_HDMI2_U_HDMI_IN.9), HDMI2/U_HDMI_SWITCH (U1_HDMI2_U_HDMI_SWITCH.56)
HDMI_B.D0_N: HDMI3/U_HDMI_IN (J2_HDMI3_U_HDMI_IN.9), HDMI3/U_HDMI_SWITCH (U1_HDMI3_U_HDMI_SWITCH.56)
HDMI_B.D0_P: HDMI0/U_HDMI_IN (J2_HDMI0_U_HDMI_IN.7), HDMI0/U_HDMI_SWITCH (U1_HDMI0_U_HDMI_SWITCH.57)
HDMI_B.D0_P: HDMI1/U_HDMI_IN (J2_HDMI1_U_HDMI_IN.7), HDMI1/U_HDMI_SWITCH (U1_HDMI1_U_HDMI_SWITCH.57)
HDMI_B.D0_P: HDMI2/U_HDMI_IN (J2_HDMI2_U_HDMI_IN.7), HDMI2/U_HDMI_SWITCH (U1_HDMI2_U_HDMI_SWITCH.57)
HDMI_B.D0_P: HDMI3/U_HDMI_IN (J2_HDMI3_U_HDMI_IN.7), HDMI3/U_HDMI_SWITCH (U1_HDMI3_U_HDMI_SWITCH.57)
HDMI_B.D1_N: HDMI0/U_HDMI_IN (J2_HDMI0_U_HDMI_IN.6), HDMI0/U_HDMI_SWITCH (U1_HDMI0_U_HDMI_SWITCH.59)
HDMI_B.D1_N: HDMI1/U_HDMI_IN (J2_HDMI1_U_HDMI_IN.6), HDMI1/U_HDMI_SWITCH (U1_HDMI1_U_HDMI_SWITCH.59)
HDMI_B.D1_N: HDMI2/U_HDMI_IN (J2_HDMI2_U_HDMI_IN.6), HDMI2/U_HDMI_SWITCH (U1_HDMI2_U_HDMI_SWITCH.59)
HDMI_B.D1_N: HDMI3/U_HDMI_IN (J2_HDMI3_U_HDMI_IN.6), HDMI3/U_HDMI_SWITCH (U1_HDMI3_U_HDMI_SWITCH.59)
HDMI_B.D1_P: HDMI0/U_HDMI_IN (J2_HDMI0_U_HDMI_IN.4), HDMI0/U_HDMI_SWITCH (U1_HDMI0_U_HDMI_SWITCH.60)
HDMI_B.D1_P: HDMI1/U_HDMI_IN (J2_HDMI1_U_HDMI_IN.4), HDMI1/U_HDMI_SWITCH (U1_HDMI1_U_HDMI_SWITCH.60)
HDMI_B.D1_P: HDMI2/U_HDMI_IN (J2_HDMI2_U_HDMI_IN.4), HDMI2/U_HDMI_SWITCH (U1_HDMI2_U_HDMI_SWITCH.60)
HDMI_B.D1_P: HDMI3/U_HDMI_IN (J2_HDMI3_U_HDMI_IN.4), HDMI3/U_HDMI_SWITCH (U1_HDMI3_U_HDMI_SWITCH.60)
HDMI_B.D2_N: HDMI0/U_HDMI_IN (J2_HDMI0_U_HDMI_IN.3), HDMI0/U_HDMI_SWITCH (U1_HDMI0_U_HDMI_SWITCH.62)
HDMI_B.D2_N: HDMI1/U_HDMI_IN (J2_HDMI1_U_HDMI_IN.3), HDMI1/U_HDMI_SWITCH (U1_HDMI1_U_HDMI_SWITCH.62)
HDMI_B.D2_N: HDMI2/U_HDMI_IN (J2_HDMI2_U_HDMI_IN.3), HDMI2/U_HDMI_SWITCH (U1_HDMI2_U_HDMI_SWITCH.62)
HDMI_B.D2_N: HDMI3/U_HDMI_IN (J2_HDMI3_U_HDMI_IN.3), HDMI3/U_HDMI_SWITCH (U1_HDMI3_U_HDMI_SWITCH.62)
HDMI_B.D2_P: HDMI0/U_HDMI_IN (J2_HDMI0_U_HDMI_IN.1), HDMI0/U_HDMI_SWITCH (U1_HDMI0_U_HDMI_SWITCH.63)
HDMI_B.D2_P: HDMI1/U_HDMI_IN (J2_HDMI1_U_HDMI_IN.1), HDMI1/U_HDMI_SWITCH (U1_HDMI1_U_HDMI_SWITCH.63)
HDMI_B.D2_P: HDMI2/U_HDMI_IN (J2_HDMI2_U_HDMI_IN.1), HDMI2/U_HDMI_SWITCH (U1_HDMI2_U_HDMI_SWITCH.63)
HDMI_B.D2_P: HDMI3/U_HDMI_IN (J2_HDMI3_U_HDMI_IN.1), HDMI3/U_HDMI_SWITCH (U1_HDMI3_U_HDMI_SWITCH.63)
HDMI_OUT.CLK_N: HDMI0/U_HDMI_SWITCH (U1_HDMI0_U_HDMI_SWITCH.27), HDMI0/U_HDMI_OUT (J3_HDMI0_U_HDMI_OUT.12)
HDMI_OUT.CLK_N: HDMI1/U_HDMI_SWITCH (U1_HDMI1_U_HDMI_SWITCH.27), HDMI1/U_HDMI_OUT (J3_HDMI1_U_HDMI_OUT.12)
HDMI_OUT.CLK_N: HDMI2/U_HDMI_SWITCH (U1_HDMI2_U_HDMI_SWITCH.27), HDMI2/U_HDMI_OUT (J3_HDMI2_U_HDMI_OUT.12)
HDMI_OUT.CLK_N: HDMI3/U_HDMI_SWITCH (U1_HDMI3_U_HDMI_SWITCH.27), HDMI3/U_HDMI_OUT (J3_HDMI3_U_HDMI_OUT.12)
HDMI_OUT.CLK_P: HDMI0/U_HDMI_SWITCH (U1_HDMI0_U_HDMI_SWITCH.26), HDMI0/U_HDMI_OUT (J3_HDMI0_U_HDMI_OUT.10)
HDMI_OUT.CLK_P: HDMI1/U_HDMI_SWITCH (U1_HDMI1_U_HDMI_SWITCH.26), HDMI1/U_HDMI_OUT (J3_HDMI1_U_HDMI_OUT.10)
HDMI_OUT.CLK_P: HDMI2/U_HDMI_SWITCH (U1_HDMI2_U_HDMI_SWITCH.26), HDMI2/U_HDMI_OUT (J3_HDMI2_U_HDMI_OUT.10)
HDMI_OUT.CLK_P: HDMI3/U_HDMI_SWITCH (U1_HDMI3_U_HDMI_SWITCH.26), HDMI3/U_HDMI_OUT (J3_HDMI3_U_HDMI_OUT.10)
HDMI_OUT.D0_N: HDMI0/U_HDMI_SWITCH (U1_HDMI0_U_HDMI_SWITCH.24), HDMI0/U_HDMI_OUT (J3_HDMI0_U_HDMI_OUT.9)
HDMI_OUT.D0_N: HDMI1/U_HDMI_SWITCH (U1_HDMI1_U_HDMI_SWITCH.24), HDMI1/U_HDMI_OUT (J3_HDMI1_U_HDMI_OUT.9)
HDMI_OUT.D0_N: HDMI2/U_HDMI_SWITCH (U1_HDMI2_U_HDMI_SWITCH.24), HDMI2/U_HDMI_OUT (J3_HDMI2_U_HDMI_OUT.9)
HDMI_OUT.D0_N: HDMI3/U_HDMI_SWITCH (U1_HDMI3_U_HDMI_SWITCH.24), HDMI3/U_HDMI_OUT (J3_HDMI3_U_HDMI_OUT.9)
HDMI_OUT.D0_P: HDMI0/U_HDMI_SWITCH (U1_HDMI0_U_HDMI_SWITCH.23), HDMI0/U_HDMI_OUT (J3_HDMI0_U_HDMI_OUT.7)
HDMI_OUT.D0_P: HDMI1/U_HDMI_SWITCH (U1_HDMI1_U_HDMI_SWITCH.23), HDMI1/U_HDMI_OUT (J3_HDMI1_U_HDMI_OUT.7)
HDMI_OUT.D0_P: HDMI2/U_HDMI_SWITCH (U1_HDMI2_U_HDMI_SWITCH.23), HDMI2/U_HDMI_OUT (J3_HDMI2_U_HDMI_OUT.7)
HDMI_OUT.D0_P: HDMI3/U_HDMI_SWITCH (U1_HDMI3_U_HDMI_SWITCH.23), HDMI3/U_HDMI_OUT (J3_HDMI3_U_HDMI_OUT.7)
HDMI_OUT.D1_N: HDMI0/U_HDMI_SWITCH (U1_HDMI0_U_HDMI_SWITCH.21), HDMI0/U_HDMI_OUT (J3_HDMI0_U_HDMI_OUT.6)
HDMI_OUT.D1_N: HDMI1/U_HDMI_SWITCH (U1_HDMI1_U_HDMI_SWITCH.21), HDMI1/U_HDMI_OUT (J3_HDMI1_U_HDMI_OUT.6)
HDMI_OUT.D1_N: HDMI2/U_HDMI_SWITCH (U1_HDMI2_U_HDMI_SWITCH.21), HDMI2/U_HDMI_OUT (J3_HDMI2_U_HDMI_OUT.6)
HDMI_OUT.D1_N: HDMI3/U_HDMI_SWITCH (U1_HDMI3_U_HDMI_SWITCH.21), HDMI3/U_HDMI_OUT (J3_HDMI3_U_HDMI_OUT.6)
HDMI_OUT.D1_P: HDMI0/U_HDMI_SWITCH (U1_HDMI0_U_HDMI_SWITCH.20), HDMI0/U_HDMI_OUT (J3_HDMI0_U_HDMI_OUT.4)
HDMI_OUT.D1_P: HDMI1/U_HDMI_SWITCH (U1_HDMI1_U_HDMI_SWITCH.20), HDMI1/U_HDMI_OUT (J3_HDMI1_U_HDMI_OUT.4)
HDMI_OUT.D1_P: HDMI2/U_HDMI_SWITCH (U1_HDMI2_U_HDMI_SWITCH.20), HDMI2/U_HDMI_OUT (J3_HDMI2_U_HDMI_OUT.4)
HDMI_OUT.D1_P: HDMI3/U_HDMI_SWITCH (U1_HDMI3_U_HDMI_SWITCH.20), HDMI3/U_HDMI_OUT (J3_HDMI3_U_HDMI_OUT.4)
HDMI_OUT.D2_N: HDMI0/U_HDMI_SWITCH (U1_HDMI0_U_HDMI_SWITCH.18), HDMI0/U_HDMI_OUT (J3_HDMI0_U_HDMI_OUT.3)
HDMI_OUT.D2_N: HDMI1/U_HDMI_SWITCH (U1_HDMI1_U_HDMI_SWITCH.18), HDMI1/U_HDMI_OUT (J3_HDMI1_U_HDMI_OUT.3)
HDMI_OUT.D2_N: HDMI2/U_HDMI_SWITCH (U1_HDMI2_U_HDMI_SWITCH.18), HDMI2/U_HDMI_OUT (J3_HDMI2_U_HDMI_OUT.3)
HDMI_OUT.D2_N: HDMI3/U_HDMI_SWITCH (U1_HDMI3_U_HDMI_SWITCH.18), HDMI3/U_HDMI_OUT (J3_HDMI3_U_HDMI_OUT.3)
HDMI_OUT.D2_P: HDMI0/U_HDMI_SWITCH (U1_HDMI0_U_HDMI_SWITCH.17), HDMI0/U_HDMI_OUT (J3_HDMI0_U_HDMI_OUT.1)
HDMI_OUT.D2_P: HDMI1/U_HDMI_SWITCH (U1_HDMI1_U_HDMI_SWITCH.17), HDMI1/U_HDMI_OUT (J3_HDMI1_U_HDMI_OUT.1)
HDMI_OUT.D2_P: HDMI2/U_HDMI_SWITCH (U1_HDMI2_U_HDMI_SWITCH.17), HDMI2/U_HDMI_OUT (J3_HDMI2_U_HDMI_OUT.1)
HDMI_OUT.D2_P: HDMI3/U_HDMI_SWITCH (U1_HDMI3_U_HDMI_SWITCH.17), HDMI3/U_HDMI_OUT (J3_HDMI3_U_HDMI_OUT.1)
NetJ1_HDMI0_U_HDMI_IN_15: HDMI0/U_HDMI_IN (J1_HDMI0_U_HDMI_IN.15), HDMI0/U_HDMI_SWITCH (U1_HDMI0_U_HDMI_SWITCH.37)
NetJ1_HDMI0_U_HDMI_IN_16: HDMI0/U_HDMI_IN (J1_HDMI0_U_HDMI_IN.16), HDMI0/U_HDMI_SWITCH (U1_HDMI0_U_HDMI_SWITCH.36)
NetJ1_HDMI0_U_HDMI_IN_17: HDMI0/U_HDMI_IN (J1_HDMI0_U_HDMI_IN.17), HDMI0/U_HDMI_SWITCH (U1_HDMI0_U_HDMI_SWITCH.35)
NetJ1_HDMI1_U_HDMI_IN_15: HDMI1/U_HDMI_IN (J1_HDMI1_U_HDMI_IN.15), HDMI1/U_HDMI_SWITCH (U1_HDMI1_U_HDMI_SWITCH.37)
NetJ1_HDMI1_U_HDMI_IN_16: HDMI1/U_HDMI_IN (J1_HDMI1_U_HDMI_IN.16), HDMI1/U_HDMI_SWITCH (U1_HDMI1_U_HDMI_SWITCH.36)
NetJ1_HDMI1_U_HDMI_IN_17: HDMI1/U_HDMI_IN (J1_HDMI1_U_HDMI_IN.17), HDMI1/U_HDMI_SWITCH (U1_HDMI1_U_HDMI_SWITCH.35)
NetJ1_HDMI2_U_HDMI_IN_15: HDMI2/U_HDMI_IN (J1_HDMI2_U_HDMI_IN.15), HDMI2/U_HDMI_SWITCH (U1_HDMI2_U_HDMI_SWITCH.37)
NetJ1_HDMI2_U_HDMI_IN_16: HDMI2/U_HDMI_IN (J1_HDMI2_U_HDMI_IN.16), HDMI2/U_HDMI_SWITCH (U1_HDMI2_U_HDMI_SWITCH.36)
NetJ1_HDMI2_U_HDMI_IN_17: HDMI2/U_HDMI_IN (J1_HDMI2_U_HDMI_IN.17), HDMI2/U_HDMI_SWITCH (U1_HDMI2_U_HDMI_SWITCH.35)
NetJ1_HDMI3_U_HDMI_IN_15: HDMI3/U_HDMI_IN (J1_HDMI3_U_HDMI_IN.15), HDMI3/U_HDMI_SWITCH (U1_HDMI3_U_HDMI_SWITCH.37)
NetJ1_HDMI3_U_HDMI_IN_16: HDMI3/U_HDMI_IN (J1_HDMI3_U_HDMI_IN.16), HDMI3/U_HDMI_SWITCH (U1_HDMI3_U_HDMI_SWITCH.36)
NetJ1_HDMI3_U_HDMI_IN_17: HDMI3/U_HDMI_IN (J1_HDMI3_U_HDMI_IN.17), HDMI3/U_HDMI_SWITCH (U1_HDMI3_U_HDMI_SWITCH.35)
NetJ2_HDMI0_U_HDMI_IN_15: HDMI0/U_HDMI_IN (J2_HDMI0_U_HDMI_IN.15), HDMI0/U_HDMI_SWITCH (U1_HDMI0_U_HDMI_SWITCH.52)
NetJ2_HDMI0_U_HDMI_IN_16: HDMI0/U_HDMI_IN (J2_HDMI0_U_HDMI_IN.16), HDMI0/U_HDMI_SWITCH (U1_HDMI0_U_HDMI_SWITCH.51)
NetJ2_HDMI0_U_HDMI_IN_17: HDMI0/U_HDMI_IN (J2_HDMI0_U_HDMI_IN.17), HDMI0/U_HDMI_SWITCH (U1_HDMI0_U_HDMI_SWITCH.50)
NetJ2_HDMI1_U_HDMI_IN_15: HDMI1/U_HDMI_IN (J2_HDMI1_U_HDMI_IN.15), HDMI1/U_HDMI_SWITCH (U1_HDMI1_U_HDMI_SWITCH.52)
NetJ2_HDMI1_U_HDMI_IN_16: HDMI1/U_HDMI_IN (J2_HDMI1_U_HDMI_IN.16), HDMI1/U_HDMI_SWITCH (U1_HDMI1_U_HDMI_SWITCH.51)
NetJ2_HDMI1_U_HDMI_IN_17: HDMI1/U_HDMI_IN (J2_HDMI1_U_HDMI_IN.17), HDMI1/U_HDMI_SWITCH (U1_HDMI1_U_HDMI_SWITCH.50)
NetJ2_HDMI2_U_HDMI_IN_15: HDMI2/U_HDMI_IN (J2_HDMI2_U_HDMI_IN.15), HDMI2/U_HDMI_SWITCH (U1_HDMI2_U_HDMI_SWITCH.52)
NetJ2_HDMI2_U_HDMI_IN_16: HDMI2/U_HDMI_IN (J2_HDMI2_U_HDMI_IN.16), HDMI2/U_HDMI_SWITCH (U1_HDMI2_U_HDMI_SWITCH.51)
NetJ2_HDMI2_U_HDMI_IN_17: HDMI2/U_HDMI_IN (J2_HDMI2_U_HDMI_IN.17), HDMI2/U_HDMI_SWITCH (U1_HDMI2_U_HDMI_SWITCH.50)
NetJ2_HDMI3_U_HDMI_IN_15: HDMI3/U_HDMI_IN (J2_HDMI3_U_HDMI_IN.15), HDMI3/U_HDMI_SWITCH (U1_HDMI3_U_HDMI_SWITCH.52)
NetJ2_HDMI3_U_HDMI_IN_16: HDMI3/U_HDMI_IN (J2_HDMI3_U_HDMI_IN.16), HDMI3/U_HDMI_SWITCH (U1_HDMI3_U_HDMI_SWITCH.51)
NetJ2_HDMI3_U_HDMI_IN_17: HDMI3/U_HDMI_IN (J2_HDMI3_U_HDMI_IN.17), HDMI3/U_HDMI_SWITCH (U1_HDMI3_U_HDMI_SWITCH.50)
NetJ3_HDMI0_U_HDMI_OUT_15: HDMI0/U_HDMI_SWITCH (U1_HDMI0_U_HDMI_SWITCH.29), HDMI0/U_HDMI_OUT (J3_HDMI0_U_HDMI_OUT.15)
NetJ3_HDMI0_U_HDMI_OUT_16: HDMI0/U_HDMI_SWITCH (U1_HDMI0_U_HDMI_SWITCH.30), HDMI0/U_HDMI_OUT (J3_HDMI0_U_HDMI_OUT.16)
NetJ3_HDMI0_U_HDMI_OUT_17: HDMI0/U_HDMI_SWITCH (U1_HDMI0_U_HDMI_SWITCH.31), HDMI0/U_HDMI_OUT (J3_HDMI0_U_HDMI_OUT.17)
NetJ3_HDMI1_U_HDMI_OUT_15: HDMI1/U_HDMI_SWITCH (U1_HDMI1_U_HDMI_SWITCH.29), HDMI1/U_HDMI_OUT (J3_HDMI1_U_HDMI_OUT.15)
NetJ3_HDMI1_U_HDMI_OUT_16: HDMI1/U_HDMI_SWITCH (U1_HDMI1_U_HDMI_SWITCH.30), HDMI1/U_HDMI_OUT (J3_HDMI1_U_HDMI_OUT.16)
NetJ3_HDMI1_U_HDMI_OUT_17: HDMI1/U_HDMI_SWITCH (U1_HDMI1_U_HDMI_SWITCH.31), HDMI1/U_HDMI_OUT (J3_HDMI1_U_HDMI_OUT.17)
NetJ3_HDMI2_U_HDMI_OUT_15: HDMI2/U_HDMI_SWITCH (U1_HDMI2_U_HDMI_SWITCH.29), HDMI2/U_HDMI_OUT (J3_HDMI2_U_HDMI_OUT.15)
NetJ3_HDMI2_U_HDMI_OUT_16: HDMI2/U_HDMI_SWITCH (U1_HDMI2_U_HDMI_SWITCH.30), HDMI2/U_HDMI_OUT (J3_HDMI2_U_HDMI_OUT.16)
NetJ3_HDMI2_U_HDMI_OUT_17: HDMI2/U_HDMI_SWITCH (U1_HDMI2_U_HDMI_SWITCH.31), HDMI2/U_HDMI_OUT (J3_HDMI2_U_HDMI_OUT.17)
NetJ3_HDMI3_U_HDMI_OUT_15: HDMI3/U_HDMI_SWITCH (U1_HDMI3_U_HDMI_SWITCH.29), HDMI3/U_HDMI_OUT (J3_HDMI3_U_HDMI_OUT.15)
NetJ3_HDMI3_U_HDMI_OUT_16: HDMI3/U_HDMI_SWITCH (U1_HDMI3_U_HDMI_SWITCH.30), HDMI3/U_HDMI_OUT (J3_HDMI3_U_HDMI_OUT.16)
NetJ3_HDMI3_U_HDMI_OUT_17: HDMI3/U_HDMI_SWITCH (U1_HDMI3_U_HDMI_SWITCH.31), HDMI3/U_HDMI_OUT (J3_HDMI3_U_HDMI_OUT.17)
NetQ1_4: HDMI0/U_HDMI_SWITCH (R3_HDMI0_U_HDMI_SWITCH.2 U1_HDMI0_U_HDMI_SWITCH.33), HDMI1/U_HDMI_SWITCH (R3_HDMI1_U_HDMI_SWITCH.2 U1_HDMI1_U_HDMI_SWITCH.33), HDMI2/U_HDMI_SWITCH (R3_HDMI2_U_HDMI_SWITCH.2 U1_HDMI2_U_HDMI_SWITCH.33), HDMI3/U_HDMI_SWITCH (R3_HDMI3_U_HDMI_SWITCH.2 U1_HDMI3_U_HDMI_SWITCH.33), SWITCH (Q1.4 R5.2)